# Altium schematic sheet SAMC21_Xplained_Pro_dual_input_power_supply.SchDoc: Power supply
size A3; Organization: ATMEL Norway; Address1: Vestre Rosten 79; Address2: N-7075 TILLER; Address3: NORWAY; DocumentNumber: A09-2419; Revision: 5; SheetNumber: 2; SheetTotal: 9; PageSetup: Record=PageOptions|CenterHorizontal=True|CenterVertical=True|PrintScale=0.71|XCorrection=1.00|YCorrection=1.00|PrintKind=0|BorderSize=5000000|LeftOffset=0|BottomOffset=0|Orientation=2|PaperLength=1000|PaperWidth=1000|Scale=100|PaperSource=15|PrintQuality=600|MediaType=1|DitherType=10|PrintScaleMode=1|PaperKind=A4 (210 x 297 mm)|PaperIndex=9
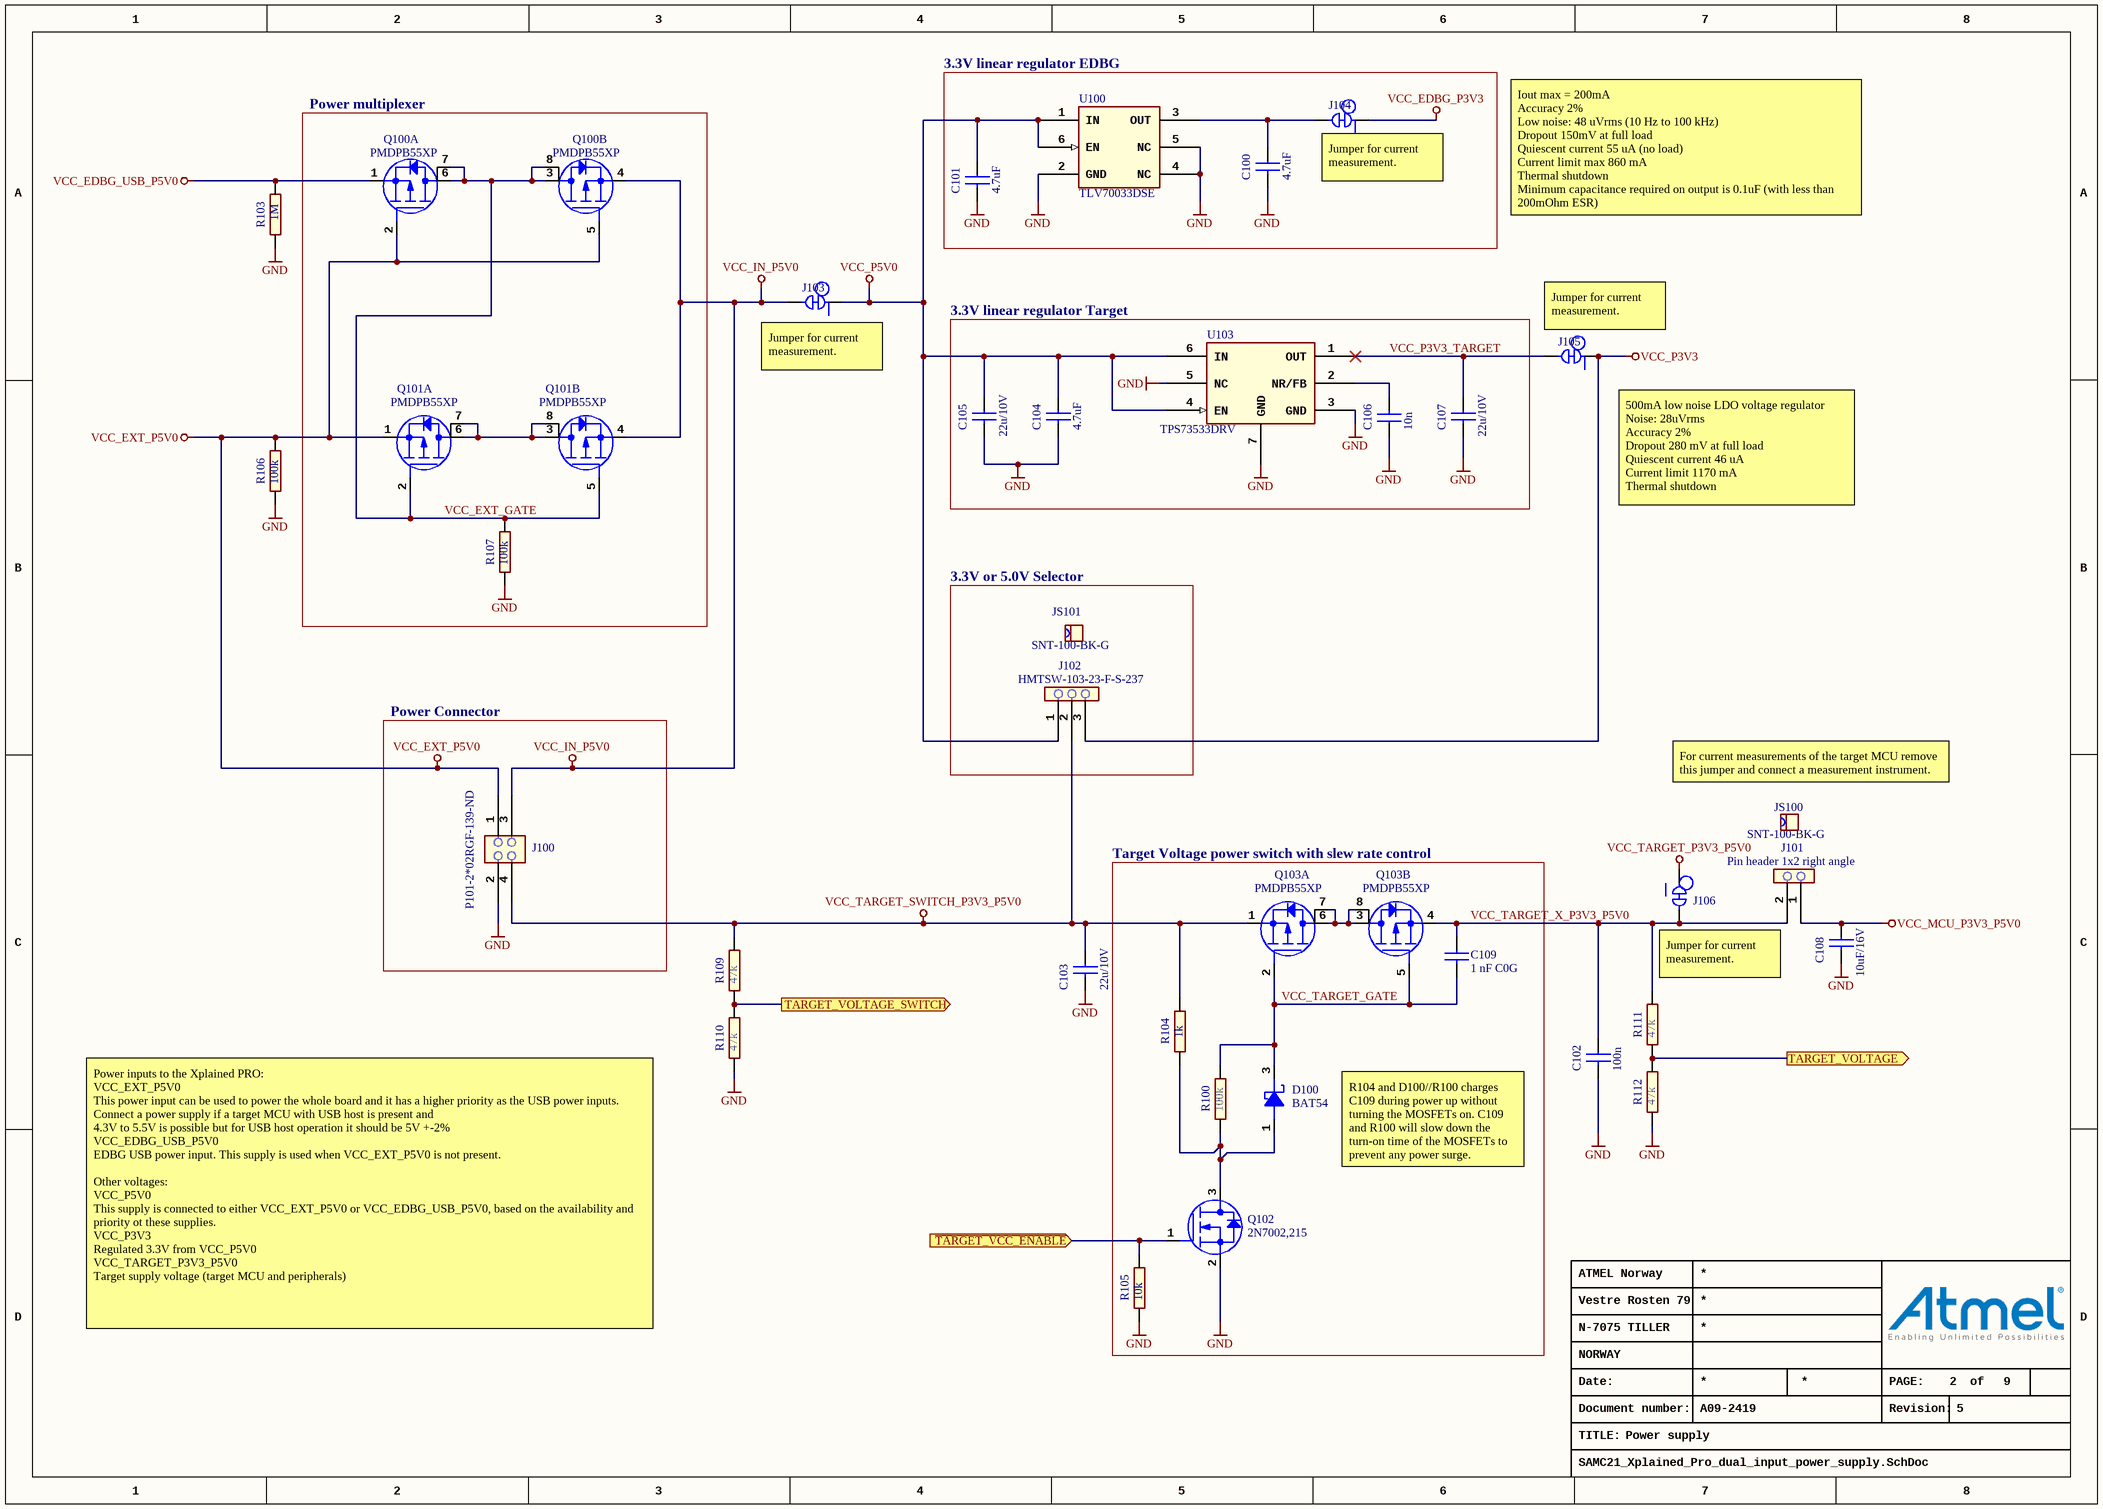
[diagram p0: SAMC21_Xplained_Pro_dual_input_power_supply.SchDoc]

## Parts
C100  value 4.7uF  [AP1-00117]
C101  value 4.7uF  [AP1-00117]
C102  value 100n  [AP1-00001]
C103  value 22u/10V  [AP1-00003]
C104  value 4.7uF  [AP1-00117]
C105  value 22u/10V  [AP1-00003]
C106  value 10n  [AP1-00053]
C107  value 22u/10V  [AP1-00003]
C108  value 10uF/16V  [AP1-00039]
C109  value 1 nF C0G  [AP1-00053]
D100  value BAT54  [AP4-00007]
J100  value P101-2*02RGF-139-ND  [AP8-00628]
J101  value Pin header 1x2 right angle  [AP8-00367]
J102  value HMTSW-103-23-F-S-237  [AP8-00745]
J103  (no value)  [AP9-00044]  (net tie, no BOM)
J104  (no value)  [AP9-00044]  (net tie, no BOM)
J105  (no value)  [AP9-00044]  (net tie, no BOM)
J106  (no value)  [AP9-00044]  (net tie, no BOM)
JS100  value SNT-100-BK-G  [AP8-00525]
JS101  value SNT-100-BK-G  [AP8-00525]
Q100  value PMDPB55XP  [AP5-00047]  (hidden comment: Farnell order code: 2191806)  (parts A,B of 2)
Q101  value PMDPB55XP  [AP5-00047]  (hidden comment: Farnell order code: 2191806)  (parts A,B of 2)
Q102  value 2N7002,215  [AP5-00002]
Q103  value PMDPB55XP  [AP5-00047]  (hidden comment: Farnell order code: 2191806)  (parts A,B of 2)
R100  value 100k  [AP2-00000]
R103  value 1M  [AP2-00000]
R104  value 1k  [AP2-00000]
R105  value 10k  [AP2-00000]
R106  value 100k  [AP2-00000]
R107  value 100k  [AP2-00000]
R109  value 47k  [AP2-00000]
R110  value 47k  [AP2-00000]
R111  value 47k  [AP2-00000]
R112  value 47k  [AP2-00000]
U100  value TLV70033DSE  [AP6-00262]
U103  value TPS73533DRV  [AP6-00162]

## Blocks framed on the sheet
Power multiplexer: Q100 Q101 R107
3.3V linear regulator EDBG: C100 C101 J104 U100
3.3V linear regulator Target: C104-C107 U103
3.3V or 5.0V Selector: J102 JS101
Power Connector: J100
Target Voltage power switch with slew rate control: C109 D100 Q102 Q103 R100 R104 R105

## Ports
TARGET_VOLTAGE (out), TARGET_VOLTAGE_SWITCH (out), ~{TARGET_VCC_ENABLE} (in)

## Nets
GND: C100.2 C101.2 C102.2 C103.2 C104.2 C105.2 C106.1 C107.2 C108.2 J100.2 Q102.2(S) R103.1 R105.1 R106.1 R107.1 R110.1 R112.1 U100.2(GND) U100.4(NC) U100.5(NC) U103.3(GND) U103.5(NC) U103.7(GND)
VCC_EDBG_P3V3: J104.1
VCC_EDBG_USB_P5V0: Q100.1(S1) R103.2
VCC_EXT_P5V0: J100.1 Q100.2(G1) Q100.5(G2) Q101.1(S1) R106.2
VCC_IN_P5V0: J100.3 J103.2 Q100.4(S2) Q101.4(S2)
VCC_MCU_P3V3_P5V0: C108.1 J101.1
VCC_P3V3: J102.3 J105.1
VCC_P5V0: C101.1 C104.1 C105.1 J102.1 J103.1 U100.1(IN) U100.6(EN) U103.4(EN) U103.6(IN)
VCC_TARGET_P3V3_P5V0: J106.1
VCC_TARGET_SWITCH_P3V3_P5V0: C103.1 J100.4 J102.2 Q103.1(S1) R104.2 R109.2
~{TARGET_VCC_ENABLE}: Q102.1(G) R105.2 ; port ~{TARGET_VCC_ENABLE}
TARGET_VOLTAGE: R111.1 R112.2 ; port TARGET_VOLTAGE
TARGET_VOLTAGE_SWITCH: R109.1 R110.2 ; port TARGET_VOLTAGE_SWITCH
VCC_EXT_GATE: Q100.3(D2) Q100.6(D1) Q100.7(D1_PAD) Q100.8(D2_PAD) Q101.2(G1) Q101.5(G2) R107.2
VCC_P3V3_TARGET: C107.1 J105.2 U103.1(OUT)
VCC_TARGET_GATE: C109.2 D100.3(CATHODE) Q103.2(G1) Q103.5(G2) R100.2
VCC_TARGET_X_P3V3_P5V0: C102.1 C109.1 J101.2 J106.2 Q103.4(S2) R111.2
NetC100_1: C100.1 J104.2 U100.3(OUT)
NetC106_2: C106.2 U103.2(NR/FB)
NetD100_1: D100.1(ANODE) Q102.3(D) R100.1 R104.1
NetQ101_3: Q101.3(D2) Q101.6(D1) Q101.7(D1_PAD) Q101.8(D2_PAD)
NetQ103_3: Q103.3(D2) Q103.6(D1) Q103.7(D1_PAD) Q103.8(D2_PAD)

## Notes on the sheet
- (near J104) Jumper for current measurement.
- Iout max = 200mA
  Accuracy 2%
  Low noise: 48 uVrms (10 Hz to 100 kHz)
  Dropout 150mV at full load
  Quiescent current 55 uA (no load)
  Current limit max 860 mA
  Thermal shutdown
  Minimum capacitance required on output is 0.1uF (with less than 200mOhm ESR)
- (near J103) Jumper for current measurement.
- (near J105) Jumper for current measurement.
- (near J105) 500mA low noise LDO voltage regulator
  Noise: 28uVrms
  Accuracy 2%
  Dropout 280 mV at full load
  Quiescent current 46 uA
  Current limit 1170 mA
  Thermal shutdown
- For current measurements of the target MCU remove this jumper and connect a measurement instrument.
- Jumper for current measurement.
- R104 and D100//R100 charges C109 during power up without turning the MOSFETs on. C109 and R100 will slow down the turn-on time of the MOSFETs to prevent any power surge.
- Power inputs to the Xplained PRO:
  VCC_EXT_P5V0
  This power input can be used to power the whole board and it has a higher priority as the USB power inputs. Connect a power supply if a target MCU with USB host is present and
  4.3V to 5.5V is possible but for USB host operation it should be 5V +-2%
  VCC_EDBG_USB_P5V0
  EDBG USB power input. This supply is used when VCC_EXT_P5V0 is not present.
  Other voltages:
  VCC_P5V0
  This supply is connected to either VCC_EXT_P5V0 or VCC_EDBG_USB_P5V0, based on the availability and priority ot these supplies.
  VCC_P3V3
  Regulated 3.3V from VCC_P5V0
  VCC_TARGET_P3V3_P5V0
  Target supply voltage (target MCU and peripherals)
- Date:
- PAGE:
- of
- TITLE:
- Document number:
- Revision:

## Library data of the parts
C100 C101 C104 = A01-0377: Ceramic capacitor, SMD 0603, X5R, 10V, 10% (de31036); PartGroup: Capacitors,Ceramic,SMD 0603; Manufacturer: tdk; MPN: C1608X5R1A475K; TemperatureRange: -55 - +85 deg C; AN: A01-0377; Tolerance: 10%; Height: 0,800000011920929
C102 = A01-0246: Ceramic capacitor, SMD 0402, X7R, 16V, +/-10%; PartGroup: Capacitors,Ceramic,SMD 0402; Manufacturer: Kemet; MPN: C0402C104K4RACTU; TemperatureRange: -55 - +125 deg C; AN: A01-0246; Tolerance: 16V, +/-10%; Height: 0,5
C103 C105 C107 = A01-0500: Ceramic capacitor, SMD 0805, X5R, 10V, Â±20%; PartGroup: Capacitors,Ceramic,SMD 0805; Manufacturer: tdk; MPN: C2012X5R1A226M/0.85; TemperatureRange: -55Â°C to +85Â°C; AN: A01-0500; Height: 0,949999988079071
C106 = A01-0050: Ceramic capacitor, SMD 0402, X7R, 25V, +/-10%; PartGroup: Capacitors,Ceramic,SMD 0402; TemperatureRange: -55 - +125 deg C; AN: A01-0050; Tolerance: 25V, +/-10%; Height: 0,550000011920929
C108 = A01-0491: Ceramic capacitor, SMD 0603, X5R, 16V, 10UF ± 20% (High Density); PartGroup: Capacitors,Ceramic,SMD 0603; Manufacturer: Taiyo Yuden; MPN: EMK107BBJ106MA-T; Tolerance: ­± 20%; TemperatureRange: -55°C to +85°C; AN: A01-0491; Height: 0,819999992847443
C109 = A01-0321: Ceramic capacitor, SMD 0402, C0G, 50V, +/-5%; PartGroup: Capacitors,Ceramic,SMD 0402; Manufacturer: Murata; MPN: GRM1555C1H102JA01D; Tolerance: 5%; AN: A01-0321; Height: 0,550000011920929
D100 = A04-0001: Schottky diode, V(rrm)=30V, I(f)=0.1A, V(f)=0.4V (at If = 0.01A), I(r)=0.5uA (at Vrrm), t(rr)=5ns, SMD SOT23; PartGroup: Diodes,Schottky; Manufacturer: Philips; NC: 2; TemperatureRange: -40 - +85 deg C; AN: A04-0001; Height: 1,10000002384186; MPN: BAT54
J100 = A08-1519: Pin header, 2x2, Right Angle, 2.54mm, THT, Pin In Paste; PartGroup: Mechanical devices,Connectors,Pin headers; Manufacturer: Pro-data International Corp; AN: A08-1519; Height: 5,07999992370605; MPN: P101-2*02RGF-139-ND
J101 = A08-0764: 1x2 pin header, right angle, 2.54 mm pitch, through-hole; PartGroup: Mechanical devices,Connectors,Pin headers; Manufacturer: Pro-data International Corp; MPN: 2213R-2G; AN: A08-0764; Height: 2,53999996185303
J102 = A08-1799: 1x3 pin header, 2.54mm pitch, Pin-in-Paste THM, 1mm hole; PartGroup: Mechanical devices,Connectors,Pin headers; Manufacturer: SAMTEC; AN: A08-1799; Height: 6,09999990463257; MPN: HMTSW-103-23-F-S-237
J103-J106 = A09-0783: Default closed SMD strap, 0603 size; PartGroup: Mechanical devices,PCB implemented components; Value: SMD-STRAP_0603_CLOSED; AN: A09-0783; Height: 0
JS100 JS101 = A08-0543: Jumper cap for 2.54mm pinheader; PartGroup: Mechanical devices,Mounting accessories,Other; Manufacturer: SAMTEC; AN: A08-0543; MPN: SNT-100-BK-G
Q100 Q101 Q103 = A05-0146: Dual P-Channel MOSFET, -20V, RDS(ON) < 55 mOhm @-3.4A@-4.5V; PartGroup: Transistors,Power FET,SMD; Manufacturer: NXP; TemperatureRange: -55Â°C to 150Â°C; AN: A05-0146; Height: 0,649999976158142; MPN: PMDPB55XP
Q102 = A05-0085: N-Channel MOSFET. 60V, 0.300A continuous, 1.2A Peak. RDS(ON) = 3.8Ohm@VGS=4.5V, VGS(th)<2.5V; PartGroup: Transistors,Small signal FET,SMD; Manufacturer: NXP; TemperatureRange: -65 to 150 deg C; AN: A05-0085; Height: 1,10000002384186; MPN: 2N7002,215
R100 R106 R107 = A02-0260: Thick film resistor, SMD 0402, 1/16W, 1%; PartGroup: Resistors,SMD,0402 1%; TemperatureRange: -55ï¿½ to +125ï¿½C; AN: A02-0260; Tolerance: 1 %; Height: 0,349999994039536
R103 = A02-0284: Thick film resistor, SMD 0402, 1/16W, 1%; PartGroup: Resistors,SMD,0402 1%; TemperatureRange: -55 - +125 deg C; AN: A02-0284; Tolerance: 1 %; Height: 0,349999994039536
R104 = A02-0212: Thick film resistor, SMD 0402, 1/16W, 1%; PartGroup: Resistors,SMD,0402 1%; TemperatureRange: -55 - +125 deg C; AN: A02-0212; Tolerance: 1 %; Height: 0,349999994039536
R105 = A02-0236: Thick film resistor, SMD 0402, 1/16W, 1%; PartGroup: Resistors,SMD,0402 1%; Manufacturer: vishay; MPN: CRCW040210K0FKED; TemperatureRange: -55 - +125 deg C; AN: A02-0236; Tolerance: 1 %; Height: 0,349999994039536
R109-R112 = A02-0252: Thick film resistor, SMD 0402, 1/16W, 1%; PartGroup: Resistors,SMD,0402 1%; TemperatureRange: -55 - +125 deg C; AN: A02-0252; Tolerance: 1 %; Height: 0,349999994039536
U100 = A06-0719: LDO, 200 mA, Iq=31 uA, Vdo=250mV, Vout=3.3V, VIN= 2 V to 5.5V, SON-6 package; PartGroup: Integrated Circuits,Regulators,Linear; Manufacturer: Texas Instruments; AN: A06-0719; Height: 0,800000011920929; MPN: TLV70033DSE
U103 = A06-1135: Low noise LDO, 500 mA, Vout=3.3V, 2% accuracy, IQ=46uA, noise=28uVrms, VIN= 2.7V to 6.5V, Vdo=280mV,stable with low ESR capacitor; PartGroup: Integrated Circuits,Regulators,Linear; Manufacturer: Texas Instruments; AN: A06-1135; Height: 0,75; MPN: TPS73533DRV